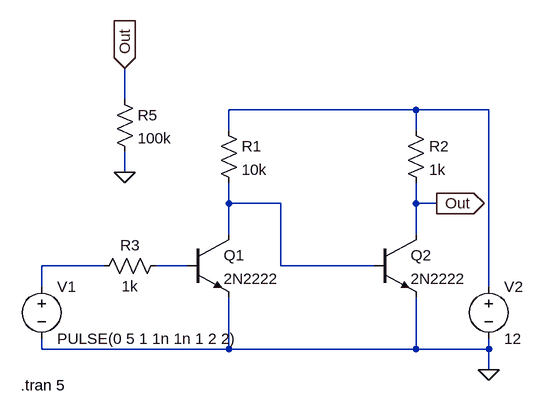
[diagram p0: schematic voltage2transistors2.asc]
voltage2transistors2.asc, the LTspice schematic file:
Version 4
SHEET 1 880 680
WIRE 224 -80 224 -128
WIRE 672 -64 384 -64
WIRE 784 -64 672 -64
WIRE 384 -32 384 -64
WIRE 672 -32 672 -64
WIRE 224 32 224 0
WIRE 384 80 384 48
WIRE 464 80 384 80
WIRE 672 80 672 48
WIRE 704 80 672 80
WIRE 384 128 384 80
WIRE 672 128 672 80
WIRE 192 176 96 176
WIRE 320 176 272 176
WIRE 464 176 464 80
WIRE 608 176 464 176
WIRE 96 208 96 176
WIRE 784 208 784 -64
WIRE 96 304 96 288
WIRE 384 304 384 224
WIRE 384 304 96 304
WIRE 672 304 672 224
WIRE 672 304 384 304
WIRE 784 304 784 288
WIRE 784 304 672 304
WIRE 784 336 784 304
FLAG 784 336 0
FLAG 704 80 Out
IOPIN 704 80 Out
FLAG 224 32 0
FLAG 224 -128 Out
IOPIN 224 -128 In
SYMBOL voltage 96 192 R0
WINDOW 123 0 0 Left 2
WINDOW 39 0 0 Left 2
SYMATTR InstName V1
SYMATTR Value PULSE(0 5 1 1n 1n 1 2 2)
SYMBOL voltage 784 192 R0
WINDOW 123 0 0 Left 2
WINDOW 39 0 0 Left 2
SYMATTR InstName V2
SYMATTR Value 12
SYMBOL npn 320 128 R0
SYMATTR InstName Q1
SYMATTR Value 2N2222
SYMBOL npn 608 128 R0
SYMATTR InstName Q2
SYMATTR Value 2N2222
SYMBOL res 368 -48 R0
SYMATTR InstName R1
SYMATTR Value 10k
SYMBOL res 656 -48 R0
SYMATTR InstName R2
SYMATTR Value 1k
SYMBOL res 288 160 R90
WINDOW 0 0 56 VBottom 2
WINDOW 3 32 56 VTop 2
SYMATTR InstName R3
SYMATTR Value 1k
SYMBOL res 208 -96 R0
SYMATTR InstName R5
SYMATTR Value 100k
TEXT 64 360 Left 2 !.tran 5

The netlist it stands for:
* voltage2transistors2.asc
V1 N003 0 PULSE(0 5 1 1n 1n 1 2 2)
V2 N001 0 12
Q1 N002 N004 0 0 2N2222
Q2 Out N002 0 0 2N2222
R1 N001 N002 10k
R2 N001 Out 1k
R3 N004 N003 1k
R5 Out 0 100k
.model NPN NPN
.model PNP PNP
.lib standard.bjt
.tran 5
.backanno
.end